# EAGLE design VCA (EAGLE 9.5.2)
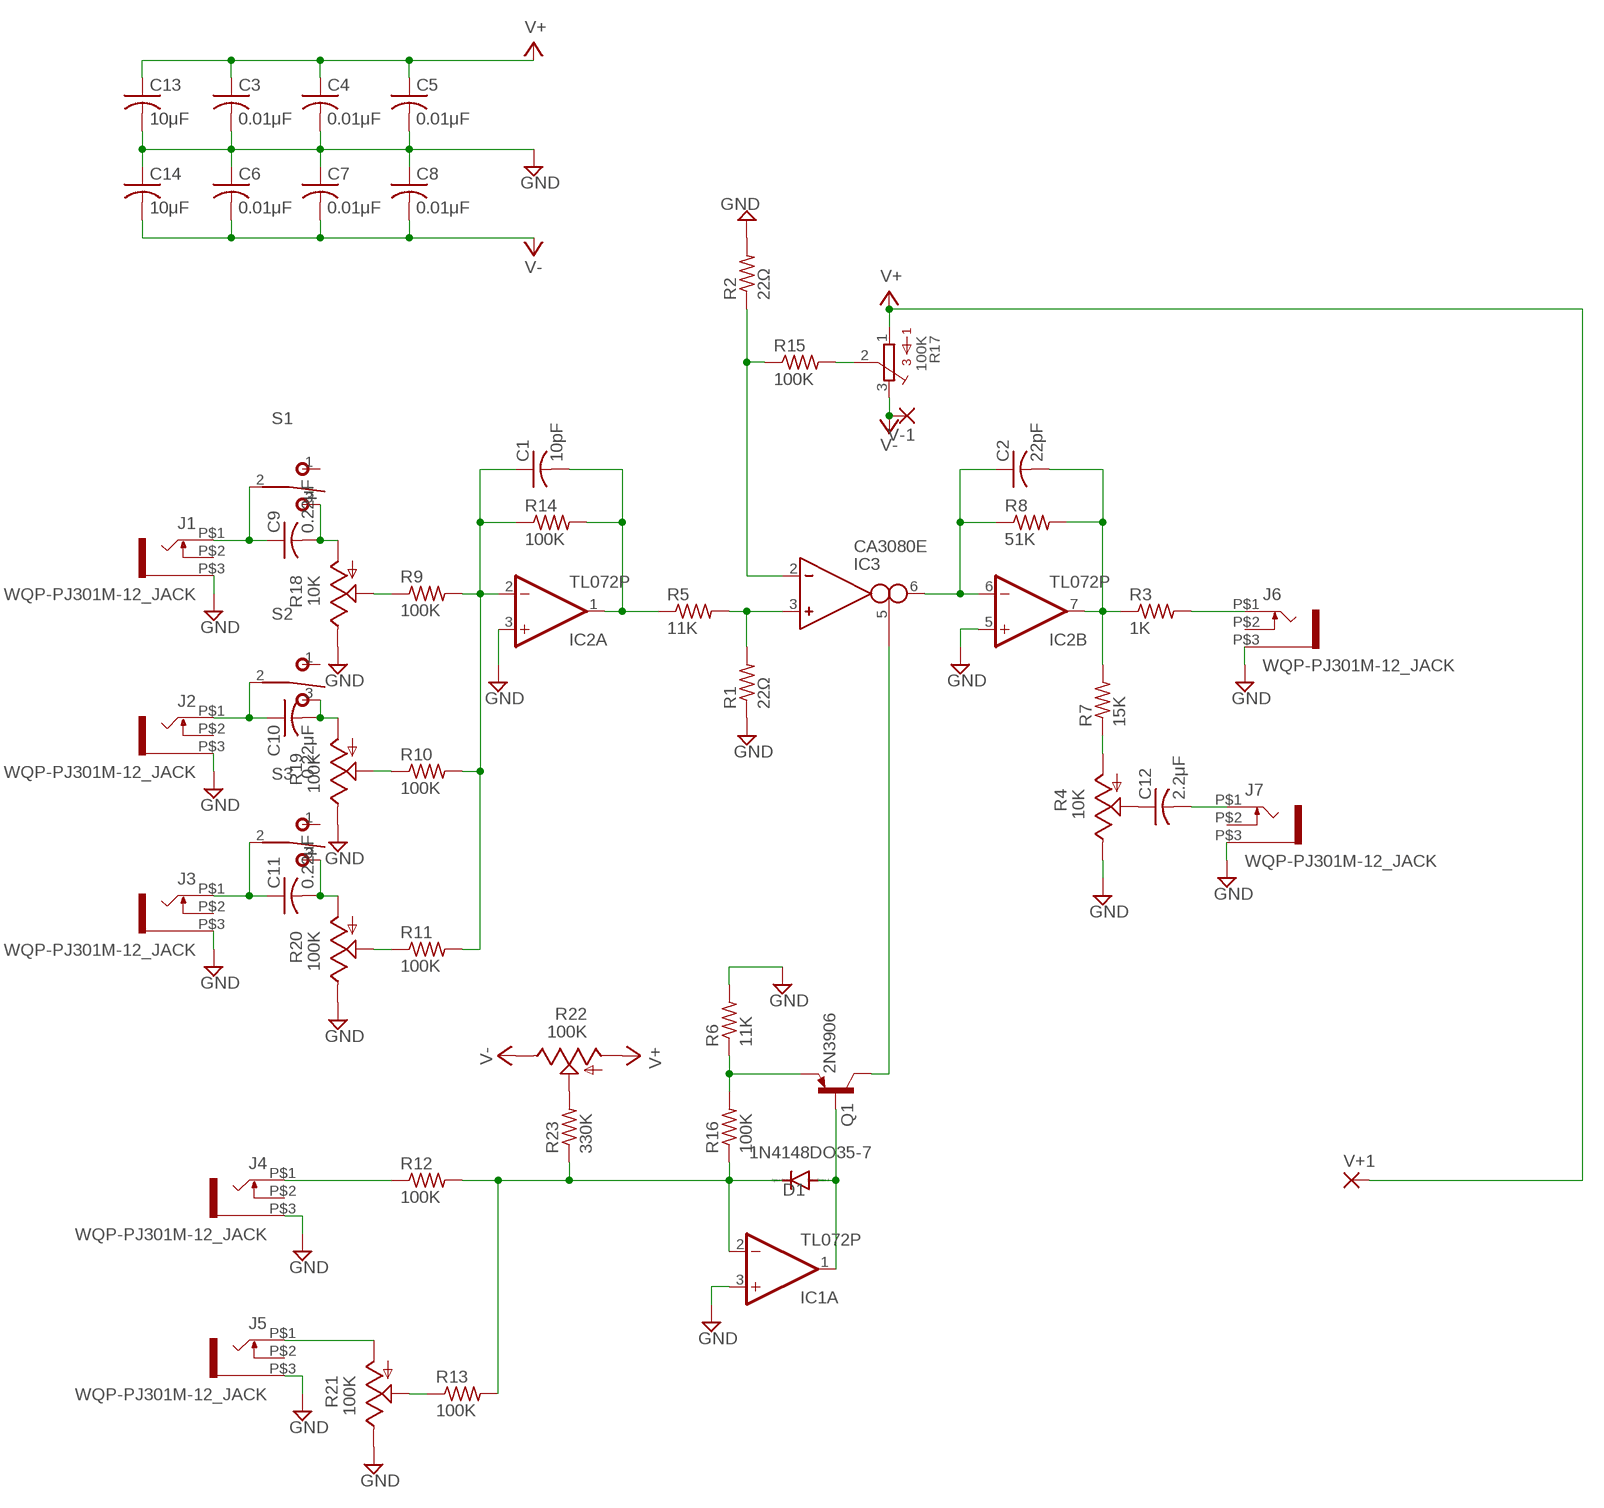
[diagram p0: schematic, sheet 1]

## Parts
C1  10pF  C-US025-024X044  [C025-024X044]
C2  22pF  C-US025-024X044  [C025-024X044]
C3  0.01μF  C-US025-024X044  [C025-024X044]
C4  0.01μF  C-US025-024X044  [C025-024X044]
C5  0.01μF  C-US025-024X044  [C025-024X044]
C6  0.01μF  C-US025-024X044  [C025-024X044]
C7  0.01μF  C-US025-024X044  [C025-024X044]
C8  0.01μF  C-US025-024X044  [C025-024X044]
C9  0.22μF  C-US025-024X044  [C025-024X044]
C10  0.22μF  C-US025-024X044  [C025-024X044]
C11  0.22μF  C-US025-024X044  [C025-024X044]
C12  2.2μF  C-US025-024X044  [C025-024X044]
C13  10μF  C-US025-024X044  [C025-024X044]
C14  10μF  C-US025-024X044  [C025-024X044]
D1  1N4148DO35-7  [DO35-7]
IC1  TL072P  [DIL08]
IC2  TL072P  [DIL08]
IC3  CA3080E  [DIL08]
J1  WQP-PJ301M-12_JACK  [WQP-PJ301M-12_JACK]
J2  WQP-PJ301M-12_JACK  [WQP-PJ301M-12_JACK]
J3  WQP-PJ301M-12_JACK  [WQP-PJ301M-12_JACK]
J4  WQP-PJ301M-12_JACK  [WQP-PJ301M-12_JACK]
J5  WQP-PJ301M-12_JACK  [WQP-PJ301M-12_JACK]
J6  WQP-PJ301M-12_JACK  [WQP-PJ301M-12_JACK]
J7  WQP-PJ301M-12_JACK  [WQP-PJ301M-12_JACK]
Q1  2N3906  [TO92]
R1  22Ω  R-US_0411/15  [0411/15]
R2  22Ω  R-US_0411/15  [0411/15]
R3  1K  R-US_0411/15  [0411/15]
R4  10K  9MM_SNAP-IN_POT_  [9MM_SNAP-IN_POT]
R5  11K  R-US_0411/15  [0411/15]
R6  11K  R-US_0411/15  [0411/15]
R7  15K  R-US_0411/15  [0411/15]
R8  51K  R-US_0411/15  [0411/15]
R9  100K  R-US_0411/15  [0411/15]
R10  100K  R-US_0411/15  [0411/15]
R11  100K  R-US_0411/15  [0411/15]
R12  100K  R-US_0411/15  [0411/15]
R13  100K  R-US_0411/15  [0411/15]
R14  100K  R-US_0411/15  [0411/15]
R15  100K  R-US_0411/15  [0411/15]
R16  100K  R-US_0411/15  [0411/15]
R17  100K  3386-C  [3386C]
R18  10K  9MM_SNAP-IN_POT_  [9MM_SNAP-IN_POT]
R19  100K  9MM_SNAP-IN_POT_  [9MM_SNAP-IN_POT]
R20  100K  9MM_SNAP-IN_POT_  [9MM_SNAP-IN_POT]
R21  100K  9MM_SNAP-IN_POT_  [9MM_SNAP-IN_POT]
R22  100K  9MM_SNAP-IN_POT_  [9MM_SNAP-IN_POT]
R23  330K  R-US_0411/15  [0411/15]
S1  T-80-T-SPDT-ON-OFF-ON  [M9040P]
S2  T-80-T-SPDT-ON-OFF-ON  [M9040P]
S3  T-80-T-SPDT-ON-OFF-ON  [M9040P]
V+1  1,6/0,8  [1,6/0,8]
V-1  1,6/0,8  [1,6/0,8]

## Nets
GND: C3.2 C4.2 C5.2 C6.1 C7.1 C8.1 C13.2 C14.1 IC1.3(A:+IN) IC2.3(A:+IN) IC2.5(B:+IN) J1.P$3 J2.P$3 J3.P$3 J4.P$3 J5.P$3 J6.P$3 J7.P$3 R1.1 R2.2 R4.3(E) R6.2 R18.3(E) R19.3(E) R20.3(E) R21.3(E)
N$1: C2.1 IC2.6(B:-IN) IC3.6(OUT) R8.1
N$2: IC3.3(IN_P) R1.2 R5.2
N$3: C1.2 IC2.1(A:OUT) R5.1 R14.2
N$4: C2.2 IC2.7(B:OUT) R3.1 R7.2 R8.2
N$5: Q1.3(E) R6.1 R16.2
N$6: IC3.2(IN_N) R2.1 R15.1
N$7: C1.1 IC2.2(A:-IN) R9.2 R10.2 R11.2 R14.1
N$8: D1.A IC1.1(A:OUT) Q1.2(B)
N$9: IC3.5(I_BIAS) Q1.1(C)
N$10: D1.C IC1.2(A:-IN) R12.2 R13.2 R16.1 R23.1
N$11: C9.1 J1.P$1 S1.2(P)
N$12: C10.1 J2.P$1 S2.2(P)
N$13: C11.1 J3.P$1 S3.2(P)
N$14: J4.P$1 R12.1
N$15: C12.2 J7.P$1
N$16: J6.P$1 R3.2
N$17: R4.1(A) R7.1
N$18: C12.1 R4.2(S)
N$19: R15.2 R17.2
N$20: R9.1 R18.2(S)
N$21: C9.2 R18.1(A) S1.3(S)
N$22: C10.2 R19.1(A) S2.3(S)
N$23: C11.2 R20.1(A) S3.3(S)
N$24: R11.1 R20.2(S)
N$25: J5.P$1 R21.1(A)
N$26: R10.1 R19.2(S)
N$27: R13.1 R21.2(S)
N$28: R22.2(S) R23.2
V+: C3.1 C4.1 C5.1 C13.1 R17.1 R22.1(A) V+1.1(P)
V-: C6.2 C7.2 C8.2 C14.2 R17.3 R22.3(E) V-1.1(P)
Unconnected: IC1.5(B:+IN) IC1.6(B:-IN) IC1.7(B:OUT) IC3.4(V-) IC3.7(V+) J1.P$2 J2.P$2 J3.P$2 J4.P$2 J5.P$2 J6.P$2 J7.P$2 S1.1(O) S2.1(O) S3.1(O)

## Power pins joined to a net without a drawn wire
V+: IC1.8(P:V+) IC2.8(P:V+)
V-: IC1.4(P:V-) IC2.4(P:V-)

## Library data of the parts
C1-C14 = rcl:C-US: CAPACITOR, American symbol; SPICEPREFIX: C
D1 = diode:1N4148: DIODE high speed (Philips)
IC1 IC2 = linear3:TL072: OP AMP
IC3 = ota:CA3080: OTA
J1-J7 = thonkiconn:WQP-PJ301M-12_JACK
Q1 = transistor-pnp:2N3906: PNP Transistor
R1-R3 R5-R16 R23 = rcl:R-US_: RESISTOR, American symbol; SPICEPREFIX: R
R4 R18-R22 = MusicThingModular:9MM_SNAP-IN_POT: 9mm vertical snap-in pot, Alpha / Panasonic style
R17 = bourns:3386-: 3386 Series 3/8" Square Trimmer
S1-S3 = MusicThingModular:T-80-T-SPDT-ON-OFF-ON
V+1 V-1 = wirepad:1,6/0,8: THROUGH-HOLE PAD

## Board
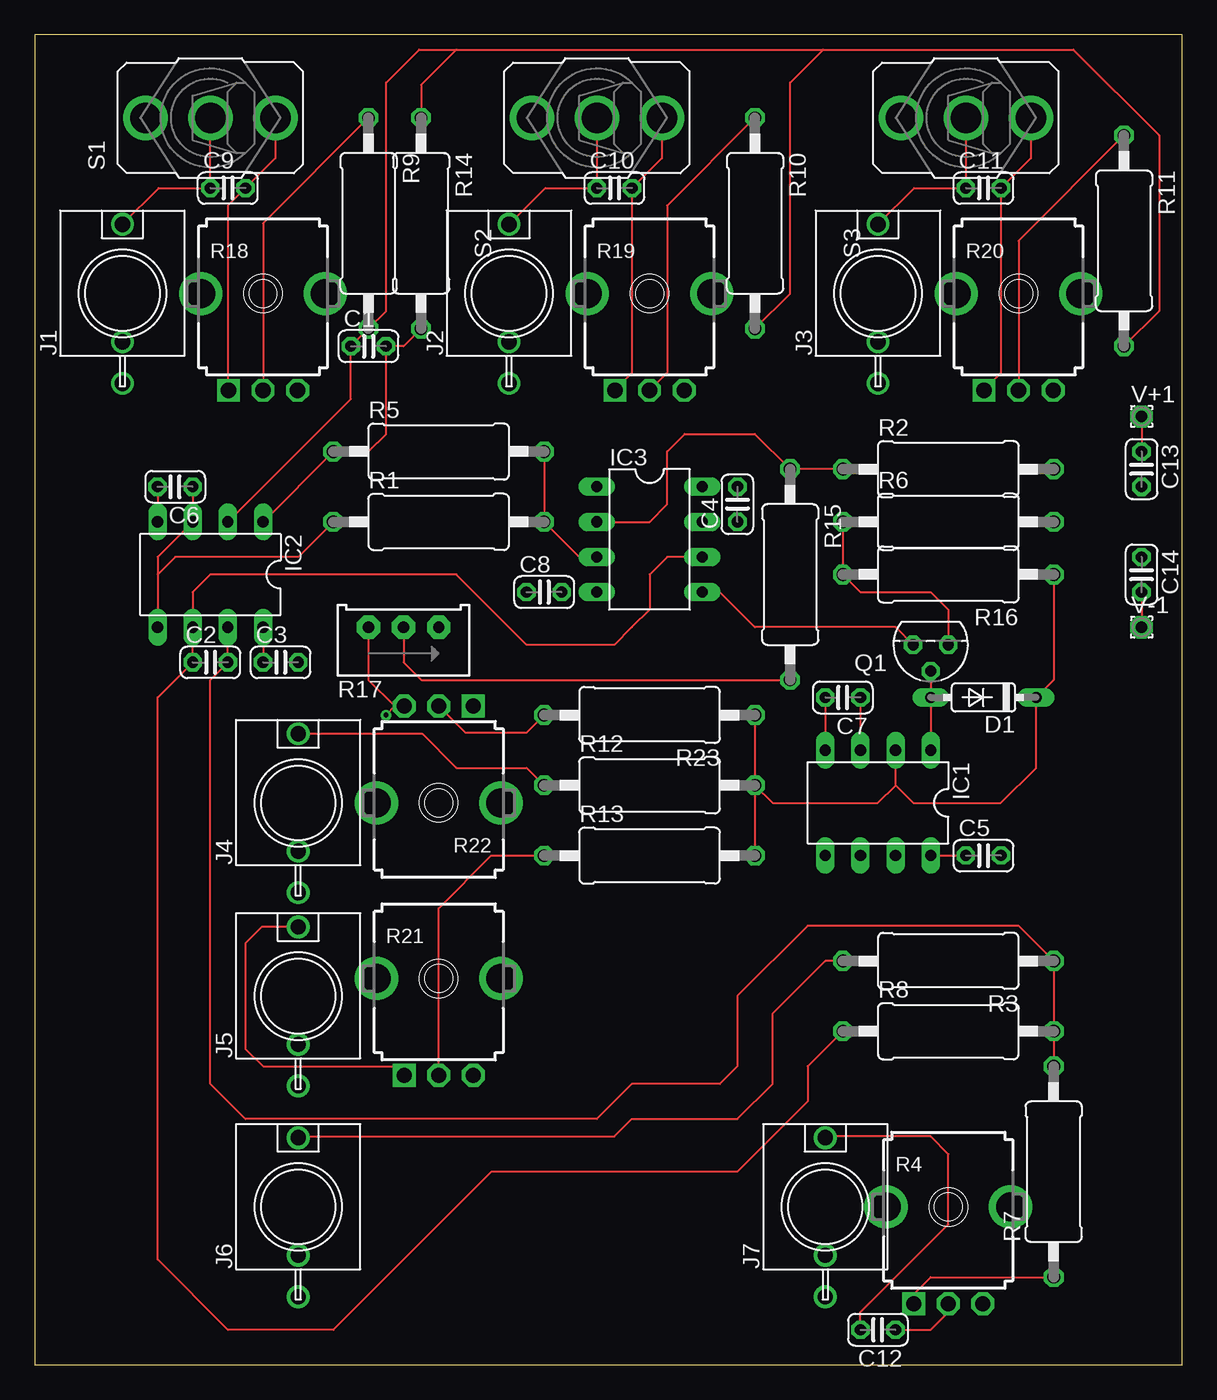
[diagram p1: board, top side]
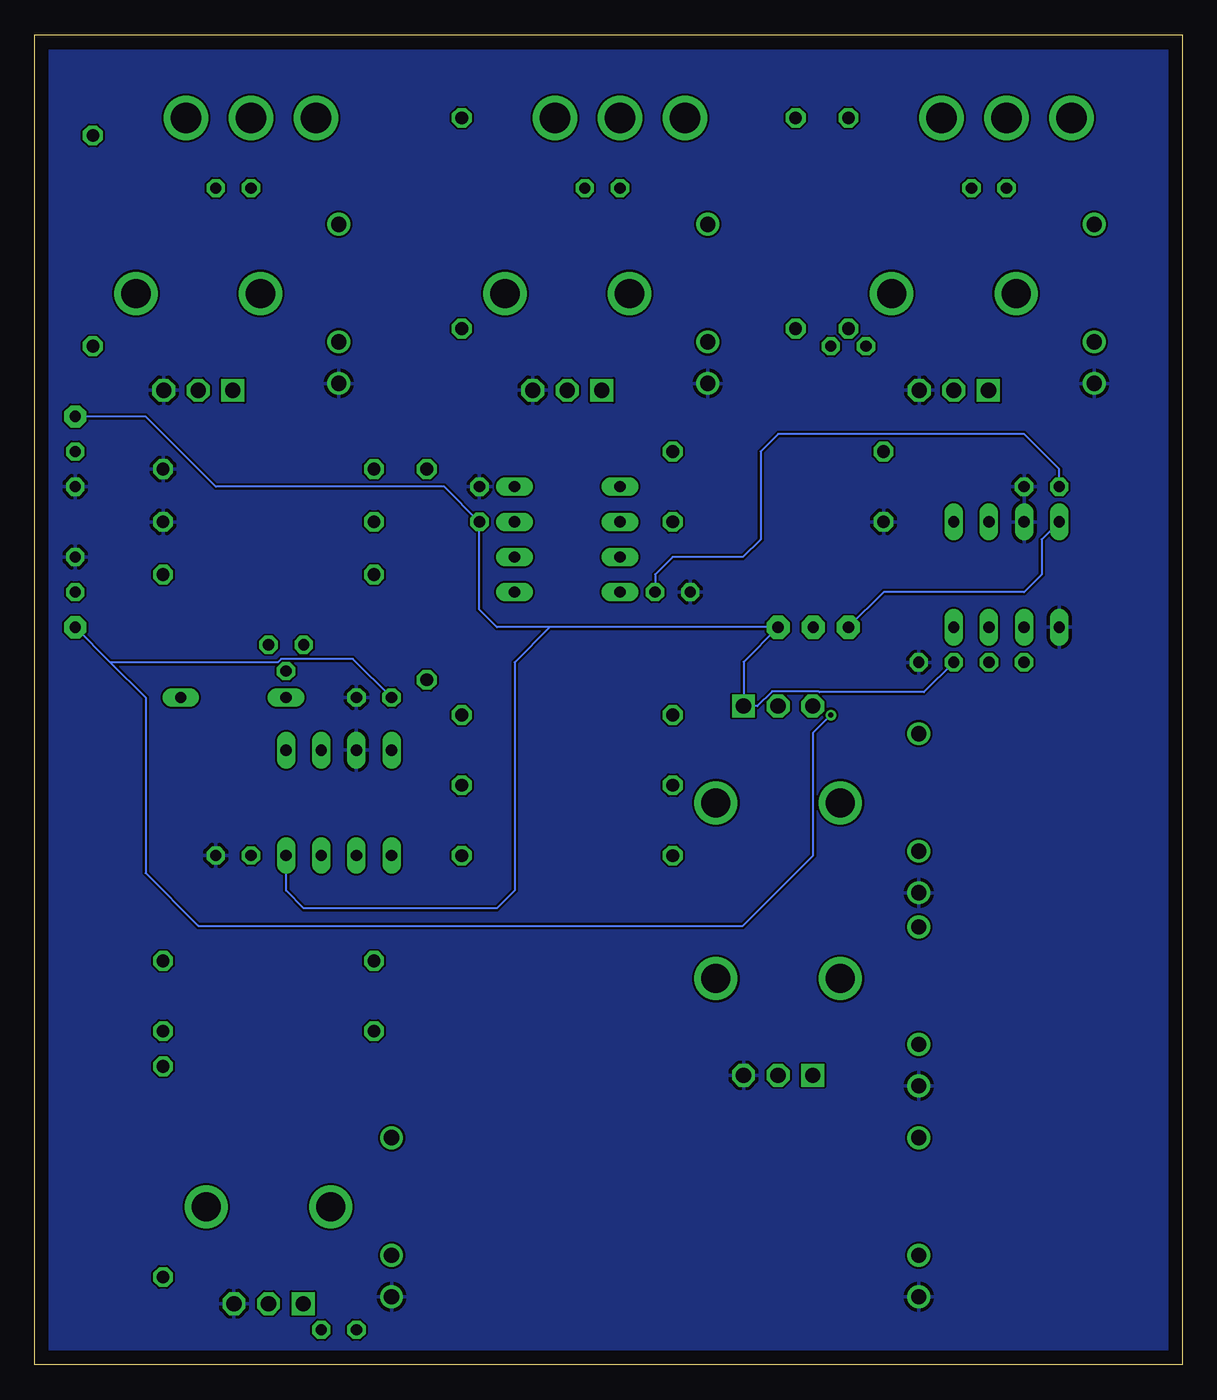
[diagram p2: board, bottom side, seen from below]

Size 82.95 x 96.19 mm. Coordinates in mm from the lower left corner, seen from the top.
Outline: 0,0 82.95,0 82.95,96.19 0,96.19 0,0
Copper layers (1*16): Top 0.035mm / dielectric 1.5mm / Bottom 0.035mm
Design rules "default": minimum track width 6mil, minimum drill 0.35mm, track to track 6mil, track to pad 6mil, pad to pad 6mil, via to via 6mil, smd to smd 6mil, copper to edge 40mil, drill to drill 6mil, minimum pad ring 10mil, minimum via ring 8mil, stop-mask expansion 4mil, vias tented up to drill 0mil, thermal gap 10mil

### Footprints (pad centres in the part's own frame; a part is rotated, then mirrored left to right if it is on the bottom)
C025-024X044 = drill 0.813 octagon: 1 -1.27,0; 2 1.27,0
DO35-7 = drill 0.813 long: A 3.81,0; C -3.81,0
DIL08 = drill 0.813 long: 1 -3.81,-3.81; 2 -1.27,-3.81; 3 1.27,-3.81; 4 3.81,-3.81; 5 3.81,3.81; 6 1.27,3.81; 7 -1.27,3.81; 8 -3.81,3.81
WQP-PJ301M-12_JACK = drill 1.1: P$1 0,5; P$2 0,-3.5; P$3 0,-6.5
TO92 = drill 0.813 octagon: 1 1.27,0; 2 0,1.905; 3 -1.27,0
0411/15 = drill 0.914 octagon: 1 -7.62,0; 2 7.62,0
9MM_SNAP-IN_POT = drill 1.1 square: 1 -2.5,-7 | drill 1.1 octagon: 2 0,-7; 3 2.5,-7 | drill 2.1 pad 2.794: CHASSIS1 -4.5,0; CHASSIS2 4.5,0
3386C = drill 0.813 pad 1.676 octagon: 1 2.54,1.27; 2 0,1.27; 3 -2.54,1.27
M9040P = drill 2.2: 1 0,4.699 | drill 2.2 pad 3: 2 0,0; 3 0,-4.699
1,6/0,8 = drill 0.813 pad 1.6 octagon: 1 0,0

### Placement (x,y rotation side)
C1  24.13,73.66 0 top
C2  12.7,50.8 0 top
C3  17.78,50.8 0 top
C4  50.8,62.23 90 top
C5  68.58,36.83 0 top
C6  10.16,63.5 180 top
C7  58.42,48.26 180 top
C8  36.83,55.88 0 top
C9  13.97,85.09 0 top
C10  41.91,85.09 0 top
C11  68.58,85.09 0 top
C12  60.96,2.54 180 top
C13  80.01,64.77 270 top
C14  80.01,57.15 270 top
D1  68.58,48.26 180 top
IC1  60.96,40.64 180 top
IC2  12.7,57.15 180 top
IC3  44.45,59.69 270 top
J1  6.35,77.47 0 top
J2  34.29,77.47 0 top
J3  60.96,77.47 0 top
J4  19.05,40.64 0 top
J5  19.05,26.67 0 top
J6  19.05,11.43 0 top
J7  57.15,11.43 0 top
Q1  64.77,52.07 180 top
R1  29.21,60.96 0 top
R2  66.04,64.77 0 top
R3  66.04,29.21 180 top
R4  66.04,11.43 0 top
R5  29.21,66.04 0 top
R6  66.04,60.96 0 top
R7  73.66,13.97 90 top
R8  66.04,24.13 0 top
R9  24.13,82.55 270 top
R10  52.07,82.55 270 top
R11  78.74,81.28 270 top
R12  44.45,41.91 0 top
R13  44.45,36.83 0 top
R14  27.94,82.55 270 top
R15  54.61,57.15 270 top
R16  66.04,57.15 180 top
R17  26.67,52.07 0 top
R18  16.51,77.47 0 top
R19  44.45,77.47 0 top
R20  71.12,77.47 0 top
R21  29.21,27.94 0 top
R22  29.21,40.64 180 top
R23  44.45,46.99 180 top
S1  12.7,90.17 90 top
S2  40.64,90.17 90 top
S3  67.31,90.17 90 top
V+1  80.01,68.58 0 top
V-1  80.01,53.34 0 top

### Tracks (layer width: path | path; a pad name or v marks a point on that pad's centre or on a via)
GND
  Top 0.152: C6.1 IC2.3 8.89,58.42 8.89,57.15 | R1.1 19.05,58.42 10.16,58.42 8.89,57.15 | 8.89,57.15 IC2.5 | C7.1 IC1.3
  pour Bottom: 0,95.25 82.55,95.25 82.55,0 0,0
N$1
  Top 0.152: IC3.6 45.72,58.42 44.45,57.15 44.45,54.61 43.18,53.34 41.91,52.07 35.56,52.07 30.48,57.15 12.7,57.15 11.43,55.88 IC2.6 C2.1 8.89,48.26 8.89,7.62 13.97,2.54 21.59,2.54 33.02,13.97 50.8,13.97 55.88,19.05 55.88,21.59 R8.1
N$2
  Top 0.152: R5.2 R1.2 39.37,58.42 IC3.3
N$3
  Top 0.152: R14.2 26.67,73.66 C1.2 25.4,67.31 24.13,66.04 R5.1 IC2.1
N$4
  Top 0.152: R7.2 R8.2 R3.1 71.12,31.75 55.88,31.75 50.8,26.67 50.8,21.59 49.53,20.32 43.18,20.32 40.64,17.78 15.24,17.78 12.7,20.32 12.7,49.53 C2.2 IC2.7
N$5
  Top 0.152: R6.1 R16.2 59.69,55.88 64.77,55.88 66.04,54.61 Q1.3
N$6
  Top 0.152: R2.1 R15.1 52.07,67.31 46.99,67.31 45.72,66.04 45.72,62.23 44.45,60.96 IC3.2
N$7
  Top 0.152: 30.48,95.1 27.79,95.1 25.4,92.71 25.4,76.2 R9.2 C1.1 22.86,69.85 IC2.2 | 30.48,95.1 57,95.1 | 57,95.1 75.08,95.1 81.28,88.9 81.28,76.2 R11.2 | R10.2 54.61,77.47 54.61,92.71 57,95.1 | 30.48,95.1 27.94,92.56 R14.1
N$8
  Top 0.152: Q1.2 D1.A IC1.1
N$9
  Top 0.152: IC3.5 49.53,55.88 52.07,53.34 62.23,53.34 Q1.1
N$10
  Top 0.152: R16.1 73.66,49.53 D1.C 72.39,43.18 69.85,40.64 63.5,40.64 62.23,41.91 | R23.1 R12.2 | R12.2 53.34,40.64 60.96,40.64 62.23,41.91 | 62.23,41.91 IC1.2 | R12.2 R13.2
N$11
  Top 0.152: S1.2 C9.1 8.97,85.09 J1.P$1
N$12
  Top 0.152: S2.2 C10.1 36.91,85.09 J2.P$1
N$13
  Top 0.152: S3.2 C11.1 63.58,85.09 J3.P$1
N$14
  Top 0.152: J4.P$1 28.02,45.64 30.48,43.18 35.56,43.18 R12.1
N$15
  Top 0.152: C12.2 59.69,3.81 66.04,10.16 66.04,15.24 64.77,16.51 57.23,16.51 J7.P$1
N$16
  Top 0.152: R3.2 57.15,29.21 53.34,25.4 53.34,20.32 50.8,17.78 43.18,17.78 41.91,16.51 19.13,16.51 J6.P$1
N$17
  Top 0.152: R4.1 63.54,5.12 64.77,6.35 R7.1
N$18
  Top 0.152: C12.1 64.77,2.54 66.04,3.81 R4.2
N$19
  Top 0.152: R17.2 26.67,50.8 27.94,49.53 R15.2
N$20
  Top 0.152: R9.1 16.51,82.55 R18.2
N$21
  Top 0.152: S1.3 17.4,87.25 C9.2 13.97,83.82 13.97,70.51 R18.1
N$22
  Top 0.152: S2.3 45.34,87.25 C10.2 43.18,71.7 R19.1
N$23
  Top 0.152: S3.3 72.01,87.25 C11.2 69.85,71.7 R20.1
N$24
  Top 0.152: R11.1 71.12,81.28 R20.2
N$25
  Top 0.152: J5.P$1 16.43,31.67 15.24,30.48 15.24,22.86 16.51,21.59 26.06,21.59 R21.1
N$26
  Top 0.152: R10.1 45.72,83.82 45.72,71.74 R19.2
N$27
  Top 0.152: R13.1 33.02,36.83 29.21,33.02 R21.2
N$28
  Top 0.152: R22.2 31.13,45.72 35.56,45.72 R23.2
V+
  Top 0.152: V+1.1 C13.1 | IC2.8 C3.1 | IC1.8 C5.1
  Bottom 0.152: 45.72,53.34 R17.1 31.71,50.84 R22.1 30.7,47.64 29.65,48.69 26.27,48.69 26.22,48.64 18.67,48.64 C3.1 | 45.72,53.34 49.53,53.34 50.8,54.61 C4.1 53.34,63.5 69.85,63.5 74.93,68.58 V+1.1 | 45.72,53.34 48.26,50.8 48.26,34.29 49.53,33.02 63.5,33.02 64.77,34.29 IC1.8
V-  (via drill 0.35)
  Top 0.152: C6.2 IC2.4 | C7.2 IC1.4 | C14.2 V-1.1 | R17.3 24.13,49.53 26.02,47.64 26.05,47.64 | R22.3 26.67,47.64 26.05,47.64 | v25.4,46.99 26.05,47.64
  Bottom 0.152: IC2.4 10.16,59.69 10.16,57.15 11.43,55.88 21.59,55.88 R17.3 | 77.47,50.8 65.39,50.8 65.14,51.05 59.94,51.05 C7.2 | 77.47,50.8 V-1.1 | C8.2 38.1,57.15 36.83,58.42 31.75,58.42 30.48,59.69 30.48,66.04 29.21,67.31 11.43,67.31 8.89,64.77 C6.2 | 77.47,50.8 74.93,48.26 74.93,35.56 71.12,31.75 31.75,31.75 26.67,36.83 26.67,45.72 v25.4,46.99